# EAGLE design Team16_FINAL (EAGLE 9.5.2)
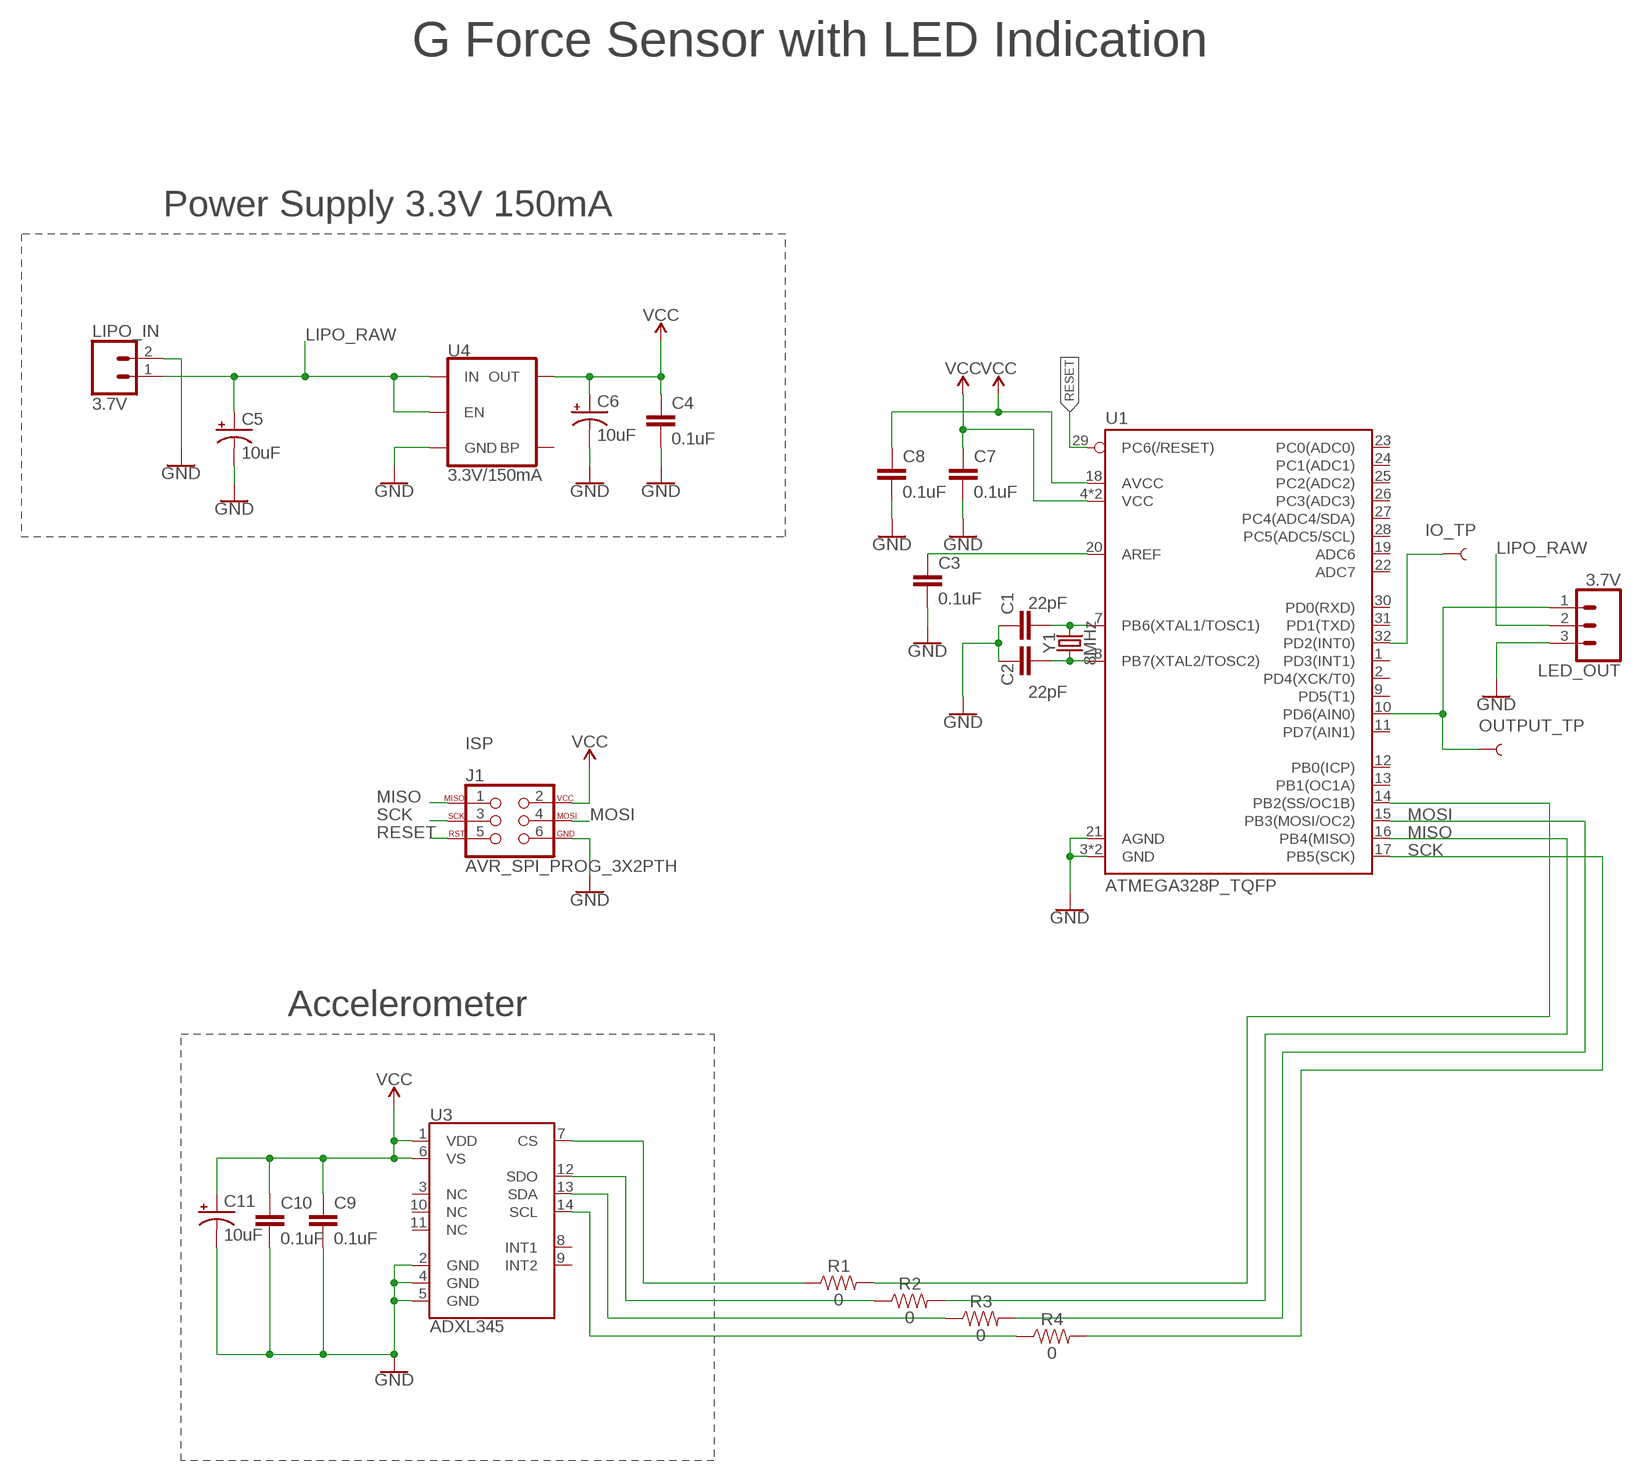
[diagram p0: schematic, sheet 1]

## Parts
C1  22pF  22PF-0603-50V-5%  [0603]
C2  22pF  22PF-0603-50V-5%  [0603]
C3  0.1uF  0.1UF-0402-16V-10%  [0402]
C4  0.1uF  0.1UF-0402-16V-10%  [0402]
C5  10uF  10UF-POLAR-0603-6.3V-20%(TANT)  [0603-POLAR]
C6  10uF  10UF-POLAR-0603-6.3V-20%(TANT)  [0603-POLAR]
C7  0.1uF  0.1UF-0402-16V-10%  [0402]
C8  0.1uF  0.1UF-0402-16V-10%  [0402]
C9  0.1uF  0.1UF-0402-16V-10%  [0402]
C10  0.1uF  0.1UF-0402-16V-10%  [0402]
C11  10uF  10UF-POLAR-0603-6.3V-20%(TANT)  [0603-POLAR]
IO_TP  TEST-POINT3  [PAD.03X.03]
J1  AVR_SPI_PROG_3X2PTH  [2X3]
LED_OUT  3.7V  CONN_03LOCK_LONGPADS  [1X03_LOCK_LONGPADS]
LIPO_IN  3.7V  CONN_02PTH3  [1X02_LONGPADS]
OUTPUT_TP  TEST-POINT3  [PAD.03X.03]
R1  0  0OHM-0402-1/10W  [0402]
R2  0  0OHM-0402-1/10W  [0402]
R3  0  0OHM-0402-1/10W  [0402]
R4  0  0OHM-0402-1/10W  [0402]
U1  ATMEGA328P_TQFP  [TQFP32-08]
U3  ADXL345  [LGA-14]
U4  3.3V/150mA  V_REG_MIC52053.3V  [SOT23-5]
Y1  8MHz  CRYSTAL-8MHZSMD-5X3.2  [CRYSTAL-SMD-5X3.2-4PAD]

## Nets
GND: C1.1 C2.1 C3.2 C4.2 C5.- C6.- C7.2 C8.2 C9.2 C10.2 C11.- J1.6 LED_OUT.3 LIPO_IN.2 U1.3(GND) U1.5(GND) U1.21(AGND) U3.2(GND) U3.4(GND) U3.5(GND) U4.2(GND)
LIPO_RAW: C5.+ LED_OUT.2 LIPO_IN.1 U4.1(IN) U4.3(EN)
MISO: J1.1 R2.2 U1.16(PB4(MISO))
MOSI: J1.4 R3.2 U1.15(PB3(MOSI/OC2))
N$1: C1.2 U1.7(PB6(XTAL1/TOSC1)) Y1.3
N$2: C2.2 U1.8(PB7(XTAL2/TOSC2)) Y1.1
N$3: LED_OUT.1 OUTPUT_TP.P$1 U1.10(PD6(AIN0))
N$4: IO_TP.P$1 U1.32(PD2(INT0))
N$5: R1.1 U3.7(CS)
N$6: R2.1 U3.12(SDO)
N$7: R3.1 U3.13(SDA)
N$8: C3.1 U1.20(AREF)
N$9: R4.1 U3.14(SCL)
N$14: R1.2 U1.14(PB2(SS/OC1B))
RESET: J1.5 U1.29(PC6(/RESET))
SCK: J1.3 R4.2 U1.17(PB5(SCK))
VCC: C4.1 C6.+ C7.1 C8.1 C9.1 C10.1 C11.+ J1.2 U1.4(VCC) U1.6(VCC) U1.18(AVCC) U3.1(VDD) U3.6(VS) U4.5(OUT)
Unconnected: U1.1(PD3(INT1)) U1.2(PD4(XCK/T0)) U1.9(PD5(T1)) U1.11(PD7(AIN1)) U1.12(PB0(ICP)) U1.13(PB1(OC1A)) U1.19(ADC6) U1.22(ADC7) U1.23(PC0(ADC0)) U1.24(PC1(ADC1)) U1.25(PC2(ADC2)) U1.26(PC3(ADC3)) U1.27(PC4(ADC4/SDA)) U1.28(PC5(ADC5/SCL)) U1.30(PD0(RXD)) U1.31(PD1(TXD)) U3.3(NC) U3.8(INT1) U3.9(INT2) U3.10(NC) U3.11(NC) U4.4(BP)

## Notes on the sheet
- G Force Sensor with LED Indication
- Power Supply 3.3V 150mA
- ISP
- Accelerometer

## Library data of the parts
C1 C2 = SparkFun-Capacitors:22PF: 22pF ceramic capacitors A capacitor is a passive two-terminal electrical component used to store electrical energy temporarily in an electric field.; PROD_ID: CAP-07876
C3 C4 C7-C10 = SparkFun-Capacitors:0.1UF: 0.1µF ceramic capacitors A capacitor is a passive two-terminal electrical component used to store electrical energy temporarily in an electric field.; PROD_ID: CAP-12416
C5 C6 C11 = SparkFun-Capacitors:10UF-POLAR: 10.0µF polarized capacitors A capacitor is a passive two-terminal electrical component used to store electrical energy temporarily in an electric field.; PROD_ID: CAP-13210
IO_TP OUTPUT_TP = SparkFun-Connectors:TEST-POINT: SparkFun Test Points Bare copper test points for troubleshooting or In-Circuit-Testing. These are used by our Production team for verifying production board runs using pogo-pins on test beds. SparkFun Products: SparkFun LSM9DS1 Breakout <https://www.sparkfun.com/products/13284> SparkFun PSOC <https://www.sparkfun.com/products/13714> SparkFun Load Cell Amplifier <https://www.sparkfun.com/products/13879>
J1 = SparkFun-Connectors:AVR_SPI_PROG_3X2: AVR ISP 6 Pin This is the reduced ISP connector for AVR programming. Common on Arduino. This footprint will take up less PCB space and can be used with a 10-pin to 6-pin adapter such as SKU: BOB-08508 **Special note about "TEST_POINT" package. The stop mask is on the top side, so if you want your programming test points to be on the bottom of your board, make sure to place this package on the bottom side of the board. This also ensure that the orientation to program from the bottom side will be correct. SparkFun Products: SparkFun ISP Pogo Adapter <https://www.sparkfun.com/products/11591> - NS Tiny AVR Programmer <https://www.sparkfun.com/products/11801> -PTH
LED_OUT = SparkFun-Connectors:CONN_03: Multi connection point. Often used as Generic Header-pin footprint for 0.1 inch spaced/style header connections On any of the 0.1 inch spaced packages, you can populate with these: Break Away Headers - Straight <https://www.sparkfun.com/products/116> (PRT-00116) Break Away Male Headers - Right Angle <https://www.sparkfun.com/products/553> (PRT-00553) Female Headers <https://www.sparkfun.com/products/115> (PRT-00115) Break Away Headers - Machine Pin <https://www.sparkfun.com/products/117> (PRT-00117) Break Away Female Headers - Swiss Machine Pin <https://www.sparkfun.com/products/743> (PRT-00743) Stackable Header - 3 Pin (Female, 0.1") <https://www.sparkfun.com/products/13875> (PRT-13875) For SCREWTERMINALS and SPRING TERMINALS visit here: Screw Terimnals on SparkFun.com <https://www.sparkfun.com/search/results?term=Screw+Terminals> (5mm/3.5mm/2.54mm spacing) This device is also useful as a general connection point to wire up your design to another part of your project. Our various solder wires solder well into these plated through hole pads. Hook-Up Wire - Assortment (Stranded, 22 AWG) <https://www.sparkfun.com/products/11375> (PRT-11375) Hook-Up Wire - Assortment (Solid Core, 22 AWG) <https://www.sparkfun.com/products/11367> (PRT-11367) View the entire wire category on our website here <https://www.sparkfun.com/categories/141> Special notes: Molex polarized connector foot print use with SKU : PRT-08232 with associated crimp pins and housings.
LIPO_IN = SparkFun-Connectors:CONN_02: Multi connection point. Often used as Generic Header-pin footprint for 0.1 inch spaced/style header connections On any of the 0.1 inch spaced packages, you can populate with these: Break Away Headers - Straight <https://www.sparkfun.com/products/116> (PRT-00116) Break Away Male Headers - Right Angle <https://www.sparkfun.com/products/553> (PRT-00553) Female Headers <https://www.sparkfun.com/products/115> (PRT-00115) Break Away Headers - Machine Pin <https://www.sparkfun.com/products/117> (PRT-00117) Break Away Female Headers - Swiss Machine Pin <https://www.sparkfun.com/products/743> (PRT-00743) For SCREWTERMINALS and SPRING TERMINALS visit here: Screw Terimnals on SparkFun.com <https://www.sparkfun.com/search/results?term=Screw+Terminals> (5mm/3.5mm/2.54mm spacing) This device is also useful as a general connection point to wire up your design to another part of your project. Our various solder wires solder well into these plated through hole pads. Hook-Up Wire - Assortment (Stranded, 22 AWG) <https://www.sparkfun.com/products/11375> (PRT-11375) Hook-Up Wire - Assortment (Solid Core, 22 AWG) <https://www.sparkfun.com/products/11367> (PRT-11367) View the entire wire category on our website here <https://www.sparkfun.com/categories/141> Special notes: Molex polarized connector foot print use with: PRT-08233 with associated crimp pins and housings. 2.54_SCREWTERM for use with PRT-10571. 3.5mm Screw Terminal footprints for PRT-08084 5mm Screw Terminal footprints for use with PRT-08432
R1-R4 = SparkFun-Resistors:0OHM: 0Ω resistor A resistor is a passive two-terminal electrical component that implements electrical resistance as a circuit element. Resistors act to reduce current flow, and, at the same time, act to lower voltage levels within circuits. - Wikipedia; PROD_ID: RES-14244
U1 = SparkFun-IC-Microcontroller:ATMEGA328P_TQFP: Popular 328P in QFP Storefront component: ATmega328 - TQFP <https://www.sparkfun.com/products/13448> (COM-13448) Datasheet <http://www.sparkfun.com/datasheets/Components/SMD/ATMega328.pdf> SparkFun Products SparkFun RedBoard - Programmed with Arduino <https://www.sparkfun.com/products/12757> (DEV-12757) Arduino Pro Mini 328 - 5V/16MHz <https://www.sparkfun.com/products/11113> (DEV-11113) Arduino Pro Mini 328 - 3.3V/8MHz <https://www.sparkfun.com/products/11114> (DEV-11114) SparkFun OpenLog <https://www.sparkfun.com/products/13712> (DEV-13712) SparkFun MicroView - OLED Arduino Module <https://www.sparkfun.com/products/12923> (DEV-12923) SparkFun Digital Sandbox <https://www.sparkfun.com/products/12651> (DEV-12651) SparkFun PicoBoard <https://www.sparkfun.com/products/11888> (WIG-11888) Arduino Fio <https://www.sparkfun.com/products/10116> (DEV-10116) LilyPad Arduino 328 Main Board <https://www.sparkfun.com/products/13342> (DEV-13342) SparkFun RedStick <https://www.sparkfun.com/products/13741> (DEV-13741) LilyPad MP3 <https://www.sparkfun.com/products/11013> (DEV-11013) LilyPad Arduino SimpleSnap <https://www.sparkfun.com/products/10941> (DEV-10941) SparkFun Stepoko <https://www.sparkfun.com/products/13899> (ROB-13899) SparkFun Geiger Counter <https://www.sparkfun.com/products/11345> (SEN-11345) SparkFun EL Sequencer <https://www.sparkfun.com/products/12781> (COM-12781) Arduino Pro 328 - 5V/16MHz <https://www.sparkfun.com/products/10915> (DEV-10915) CryptoCape <https://www.sparkfun.com/products/12773> (DEV-12773) SparkFun IR Thermometer Evaluation Board - MLX90614 <https://www.sparkfun.com/products/10740> (SEN-10740) SparkFun RedBot Mainboard <https://www.sparkfun.com/products/12097> (ROB-12097) Arduino Pro 328 - 3.3V/8MHz <https://www.sparkfun.com/products/10914> (DEV-10914) SparkFun Block for Intel® Edison - Arduino <https://www.sparkfun.com/products/13036> (DEV-13036) SparkFun Simon Says - Surface Mount Soldering Kit <https://www.sparkfun.com/products/10935> (KIT-10935) SparkFun 7-Segment Serial Display - Red <https://www.sparkfun.com/products/11441> (COM-11441) SparkFun 7-Segment Serial Display - White <https://www.sparkfun.com/products/11629> (COM-11629) SparkFun 7-Segment Serial Display - Yellow <https://www.sparkfun.com/products/11443> (COM-11443) SparkFun 7-Segment Serial Display - Kelly Green <https://www.sparkfun.com/products/11440> (COM-11440) SparkFun 7-Segment Serial Display - Blue <https://www.sparkfun.com/products/11442> (COM-11442) SparkFun OpenSegment Serial Display - 20mm (Blue) <https://www.sparkfun.com/products/11647> (COM-11647) SparkFun OpenSegment Serial Display - 20mm (Green) <https://www.sparkfun.com/products/11646> (COM-11646) SparkFun OpenSegment Serial Display - 20mm (White) <https://www.sparkfun.com/products/11648> (COM-11648) SparkFun OpenSegment Serial Display - 20mm (Red) <https://www.sparkfun.com/products/11644> (COM-11644) SparkFun OpenSegment Serial Display - 20mm (Yellow) <https://www.sparkfun.com/products/11645> (COM-11645) SparkFun OpenSegment Shield <https://www.sparkfun.com/products/13190> (DEV-13190); PROD_ID: IC-09069
U3 = SparkFun-Sensors:ADXL345: Analog Devices ADXL345 3-Axis SPI/I2C 2/4/8/16g Accelerometer The ADXL345 is a small, thin, low power, 3-axis accelerometer with high resolution (13-bit) measurement at up to ±16g. Digital output data is formatted as 16-bit twos complement and is accessible through either a SPI (3- or 4-wire) or I2C digital interface. Datasheet <https://www.sparkfun.com/datasheets/Sensors/Accelerometer/ADXL345.pdf> SparkFun Products SparkFun Triple Axis Accelerometer Breakout - ADXL345 <https://www.sparkfun.com/products/9836> (SEN-09836) Triple Axis Accelerometer - ADXL345 <https://www.sparkfun.com/products/9045> (SEN-09045) SparkFun 6 Degrees of Freedom IMU Digital Combo Board - ITG3200/ADXL345 <https://www.sparkfun.com/products/10121> (SEN-10121); PROD_ID: IC-09097; SF_ID: SEN-09045
U4 = SparkFun-IC-Power:V_REG_MIC5205: V_REG MIC5205 Standard 3.3V, 5V, and Adjustable 150mA LDO voltage regulator in SOT-23 layout. Micrel part MIC5205. BP (by-pass) pin is used to lower output noise with 470pF cap, may be left open. On the adjustable version BP is used to set output.; PROD_ID: VREG-00822
Y1 = SparkFun-Clocks:CRYSTAL-8MHZ: 8MHz Crystal Datasheet Example <http://www.futureelectronics.com/en/technologies/electromechanical/timing-devices/crystals/Pages/6008189-ABM3B-8.000MHZ-B2-T.aspx?IM=0> Frequency: 8MHz Frequency Tolerance: ±20ppm Load Capacitance: 18pF SparkFun Products: Pro Micro -3.3V/8MHz <https://www.sparkfun.com/products/12587> WAV Trigger <https://www.sparkfun.com/products/13660>; PROD_ID: XTAL-09431

## Board
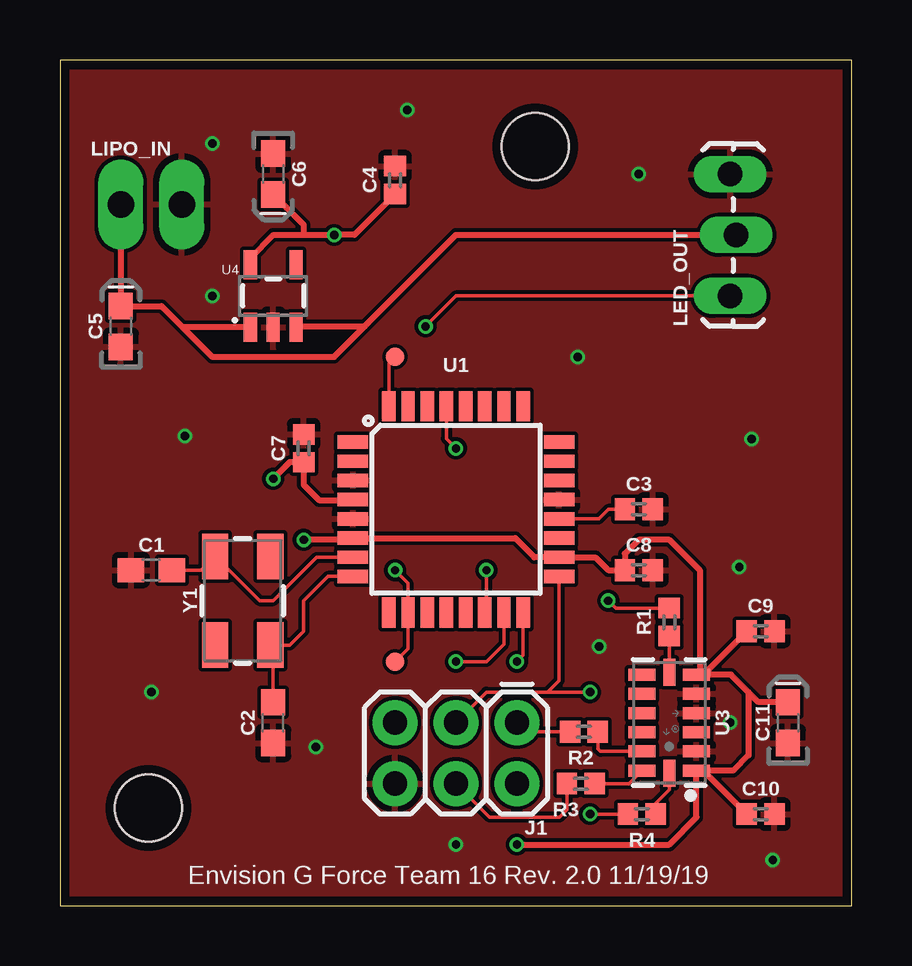
[diagram p1: board, top side]
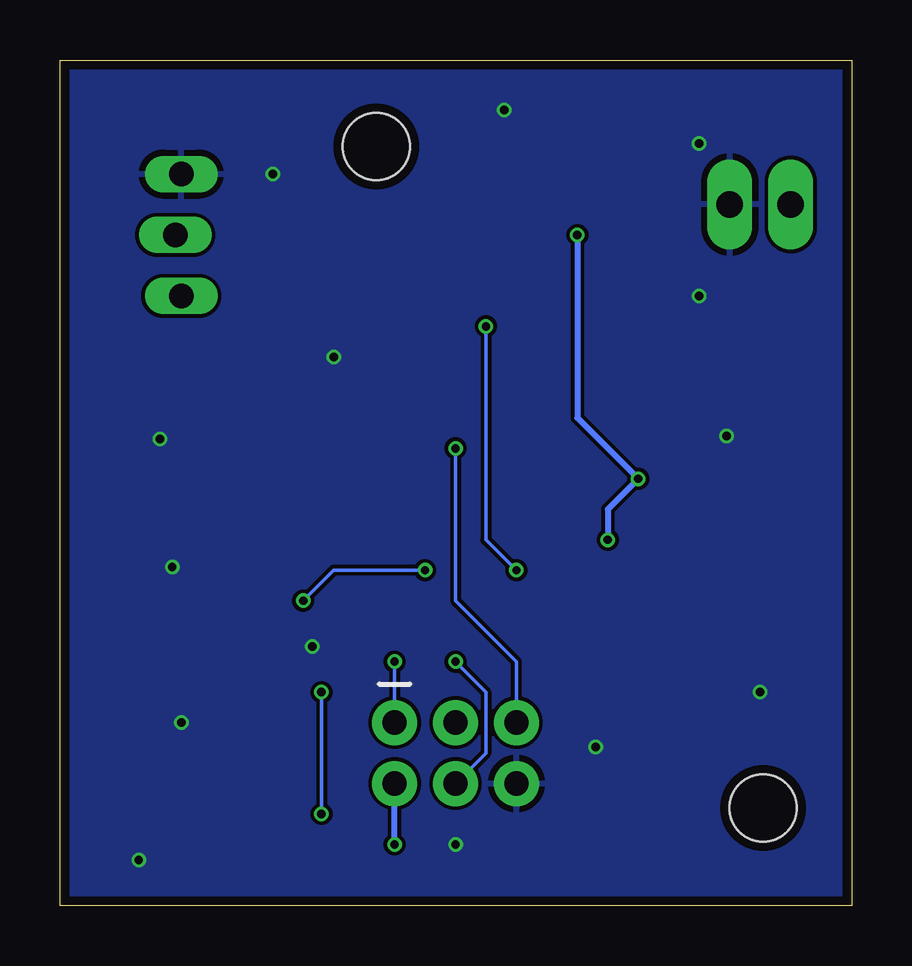
[diagram p2: board, bottom side, seen from below]

Size 33 x 35.23 mm. Coordinates in mm from the lower left corner, seen from the top.
Outline: 0,0 33,0 33,35.23 0,35.23 0,0
Copper layers (1*16): Top 0.035559375mm / dielectric 1.6mm / Bottom 0.035559375mm
Design rules "oshpark-2layer": minimum track width 6mil, minimum drill 10mil, track to track 6mil, track to pad 6mil, pad to pad 6mil, via to via 6mil, smd to smd 6mil, copper to edge 15mil, drill to drill 6mil, minimum pad ring 5mil, minimum via ring 5mil, stop-mask expansion 2.5mil, vias tented up to drill 0mil, thermal gap 10mil
Holes 2.79 mm at 3.68,4.06 19.81,31.62

### Footprints (pad centres in the part's own frame; a part is rotated, then mirrored left to right if it is on the bottom)
0603 = smd 1.1 x 1: 1 -0.85,0; 2 0.85,0
0402 = smd 0.85 x 0.9: 1 -0.58,0; 2 0.58,0
0603-POLAR = smd 1.1 x 1: + 0.85,0; - -0.85,0
PAD.03X.03 = smd 0.762 x 0.762: P$1 0,0
2X3 = drill 1.016 pad 1.88: 1 0,0; 2 0,2.54; 3 2.54,0; 4 2.54,2.54; 5 5.08,0; 6 5.08,2.54
1X03_LOCK_LONGPADS = drill 1.016 long: 1 0,0; 2 2.54,-0.254; 3 5.08,0
1X02_LONGPADS = drill 1.118 pad 1.88 long: 1 0,0; 2 2.54,0
TQFP32-08 = smd 1.27 x 0.559: 1 -4.293,2.8; 2 -4.293,2; 3 -4.293,1.2; 4 -4.293,0.4; 5 -4.293,-0.4; 6 -4.293,-1.2; 7 -4.293,-2; 8 -4.293,-2.8; 17 4.293,-2.8; 18 4.293,-2; 19 4.293,-1.2; 20 4.293,-0.4; 21 4.293,0.4; 22 4.293,1.2; 23 4.293,2; 24 4.293,2.8 | smd 0.559 x 1.27: 9 -2.8,-4.293; 10 -2,-4.293; 11 -1.2,-4.293; 12 -0.4,-4.293; 13 0.4,-4.293; 14 1.2,-4.293; 15 2,-4.293; 16 2.8,-4.293; 25 2.8,4.293; 26 2,4.293; 27 1.2,4.293; 28 0.4,4.293; 29 -0.4,4.293; 30 -1.2,4.293; 31 -2,4.293; 32 -2.8,4.293
LGA-14 = smd 0.5 x 1.124: 1 2,1.138; 2 1.2,1.138; 3 0.4,1.138; 4 -0.4,1.138; 5 -1.2,1.138; 6 -2,1.138; 8 -2,-1.13; 9 -1.2,-1.138; 10 -0.4,-1.138; 11 0.4,-1.138; 12 1.2,-1.138; 13 2,-1.138 | smd 1.124 x 0.5: 7 -2.1,0; 14 2.1,0
SOT23-5 = smd 0.55 x 1.2: 1 -0.95,-1.3; 2 0,-1.3; 3 0.95,-1.3; 4 0.95,1.3; 5 -0.95,1.3
CRYSTAL-SMD-5X3.2-4PAD = smd 1.9 x 1.1: 1 -1.85,-1.15; 2 1.85,-1.15; 3 1.85,1.15; 4 -1.85,1.15

### Placement (x,y rotation side)
C1  3.81,13.97 0 top
C2  8.89,7.62 90 top
C3  24.13,16.51 0 top
C4  13.97,30.23 90 top
C5  2.54,24.13 90 top
C6  8.89,30.48 270 top
C7  10.16,19.05 90 top
C8  24.13,13.97 0 top
C9  29.21,11.43 0 top
C10  29.21,3.81 0 top
C11  30.35,7.62 90 top
IO_TP  13.97,22.86 0 top
J1  19.05,7.62 180 top
LED_OUT  27.94,25.4 90 top
LIPO_IN  2.54,29.21 0 top
OUTPUT_TP  13.97,10.16 0 top
R1  25.4,11.81 90 top
R2  21.84,7.24 180 top
R3  21.72,5.08 180 top
R4  24.26,3.81 180 top
U1  16.51,16.51 0 top
U3  25.4,7.62 270 top
U4  8.89,25.4 0 top
Y1  7.62,12.7 90 top

### Tracks (layer width: path | path; a pad name or v marks a point on that pad's centre or on a via)
GND  (via drill 0.35)
  other vias: 27.94,7.62 10.67,6.6 24.13,30.48 6.35,31.75 6.35,25.4 28.83,19.43 5.21,19.56 28.32,14.1 22.48,10.79 21.59,22.86 3.81,8.89 16.51,2.54 29.72,1.91 14.48,33.15
  pour Top: -1.27,36.83 -1.27,-1.27 34.29,-1.27 34.29,36.83
  pour Bottom: -1.27,36.83 -1.27,-1.27 34.29,-1.27 34.29,36.83
LIPO_RAW
  Top 0.254: LIPO_IN.1 C5.+ 4.23,24.98 5.11,24.1 | U4.1 5.11,24.1 | U4.3 9.87,24.13 12.7,24.13 | 12.7,24.13 16.51,27.94 LED_OUT.2 | 5.11,24.1 6.35,22.86 11.43,22.86 12.7,24.13
MISO  (via drill 0.35)
  Top 0.152: U1.16 19.31,10.42 v19.05,10.16 | J1.1 19.43,7.24 R2.2
  Bottom 0.152: v19.05,10.16 J1.1
MOSI  (via drill 0.35)
  Top 0.152: U1.15 18.51,10.89 17.78,10.16 v16.51,10.16 | R3.2 21.14,3.99 20.83,3.68 17.91,3.68 J1.4
  Bottom 0.152: v16.51,10.16 15.24,8.89 15.24,6.35 J1.4
N$1
  Top 0.152: U1.7 10.7,14.51 8.89,12.7 8.32,12.7 Y1.3 5.89,13.97 C1.2
N$2
  Top 0.152: U1.8 11.17,13.71 10.16,12.7 10.16,11.43 9.58,10.85 Y1.1 8.89,10.73 C2.2
N$3  (via drill 0.35)
  Top 0.152: LED_OUT.1 16.51,25.4 v15.24,24.13 | v13.97,13.97 14.51,13.43 U1.10 14.51,10.7 OUTPUT_TP.P$1
  Bottom 0.152: v15.24,24.13 15.24,15.24 v13.97,13.97
N$4
  Top 0.152: U1.32 13.71,22.6 IO_TP.P$1
N$5
  Top 0.152: U3.7 R1.1
N$6
  Top 0.152: U3.12 22.54,6.42 22.42,6.53 R2.1
N$7
  Top 0.152: U3.13 23.72,5.08 R3.1
N$8
  Top 0.152: U1.20 22.46,16.11 22.86,16.51 C3.1
N$9
  Top 0.152: U3.14 25.4,4.83 24.84,4.26 R4.1
N$14  (via drill 0.35)
  Top 0.152: v17.78,13.97 17.78,12.29 U1.14 | R1.2 23.17,12.39 v22.86,12.7
  Bottom 0.152: v17.78,13.97 21.59,13.97 v22.86,12.7
RESET  (via drill 0.35)
  Top 0.152: U1.29 16.11,19.45 v16.51,19.05
  Bottom 0.152: v16.51,19.05 16.51,12.7 13.97,10.16 J1.5
SCK  (via drill 0.35)
  Top 0.152: J1.3 17.78,8.89 20.32,8.89 | 20.32,8.89 v22.1,8.89 | 20.32,8.89 20.8,9.37 U1.17 | R4.2 v22.1,3.81
  Bottom 0.152: v22.1,8.89 v22.1,3.81
VCC  (via drill 0.35)
  Top 0.254: v19.05,2.54 25.4,2.54 26.54,3.68 U3.1 26.82,5.62 | 28.7,8.89 27.97,9.62 26.82,9.62 | 26.82,5.62 28.07,5.62 28.7,6.26 28.7,8.89 | 10.16,27.94 v11.43,27.94 12.28,27.94 13.97,29.63 C4.1 | 10.16,27.94 8.89,27.94 7.94,26.99 U4.5 | C6.+ 10.16,28.36 10.16,27.94 | 26.67,9.62 U3.6 | 26.67,9.62 26.67,13.97 25.4,15.24 24.13,15.24 23.55,14.66 C8.1 22.86,13.97 22.32,14.51 U1.18 19.78,14.51 18.98,15.31 U1.6 12.15,15.24 v10.16,15.24 | v8.89,17.78 9.58,18.47 C7.1 10.16,17.53 10.79,16.89 12.2,16.89 U1.4 | C9.1 26.82,9.62 | 26.82,9.62 26.67,9.62 | C10.1 26.82,5.62 | C11.+ 29.12,8.47 28.7,8.89
  Bottom 0.254: v11.43,27.94 11.43,20.32 v8.89,17.78 10.16,16.51 v10.16,15.24 | v19.05,2.54 J1.2

### Text on the board
tPlace: Envision G Force Team 16 Rev. 2.0 11/19/19